# Altium schematic sheet connectors.SchDoc
size Letter
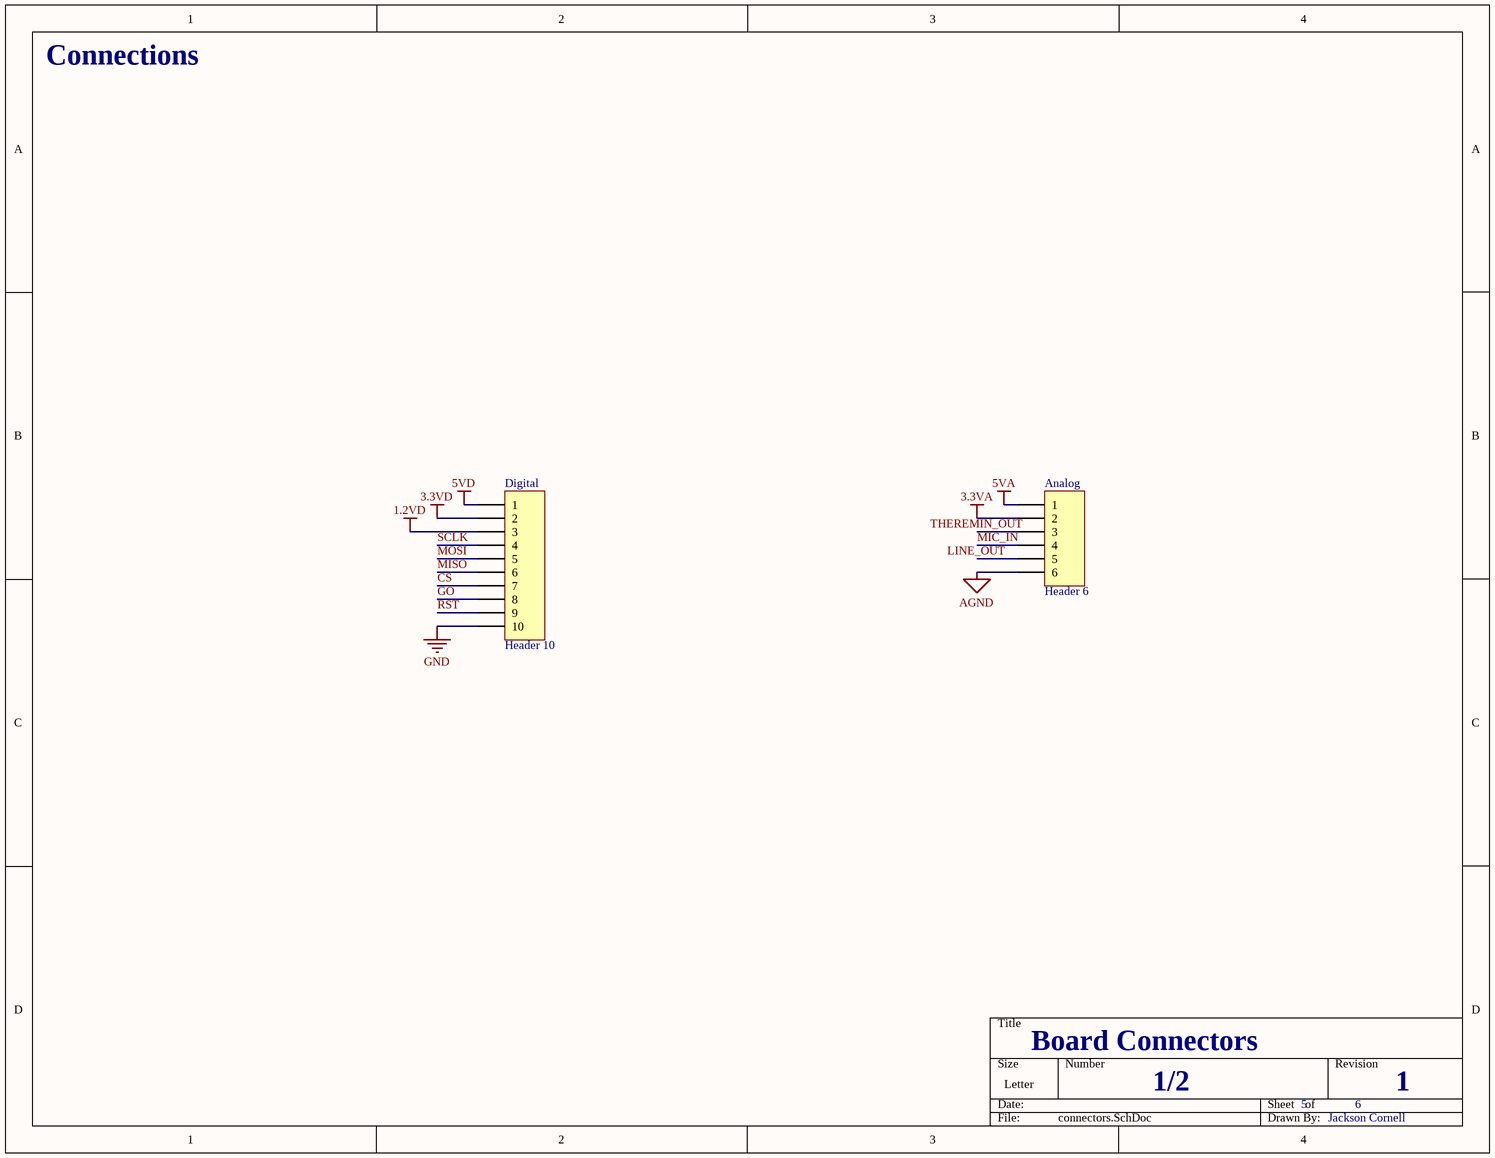
[diagram p0: connectors.SchDoc]

## Parts
Analog  Header 6  [HDR1X6]
Digital  Header 10  [HDR1X10]

## Nets
1.2VD: Digital.3
3.3VA: Analog.2
3.3VD: Digital.2
5VA: Analog.1
5VD: Digital.1
AGND: Analog.6
GND: Digital.10
CS: Digital.7
GO: Digital.8
LINE_OUT: Analog.5
MIC_IN: Analog.4
MISO: Digital.6
MOSI: Digital.5
RST: Digital.9
SCLK: Digital.4
THEREMIN_OUT: Analog.3

## Notes on the sheet
- Connections
- Board Connectors
- 1/2
- 5
- 6
- 1
- Jackson Cornell

## Library data of the parts
Analog = Header 6: Header, 6-Pin; LatestRevisionDate: 17-Jul-2002; LatestRevisionNote: Re-released for DXP Platform.; Publisher: Altium Limited
Digital = Header 10: Header, 10-Pin; LatestRevisionDate: 17-Jul-2002; LatestRevisionNote: Re-released for DXP Platform.; Publisher: Altium Limited